# EAGLE design barBloom3 (EAGLE 7.7.0)
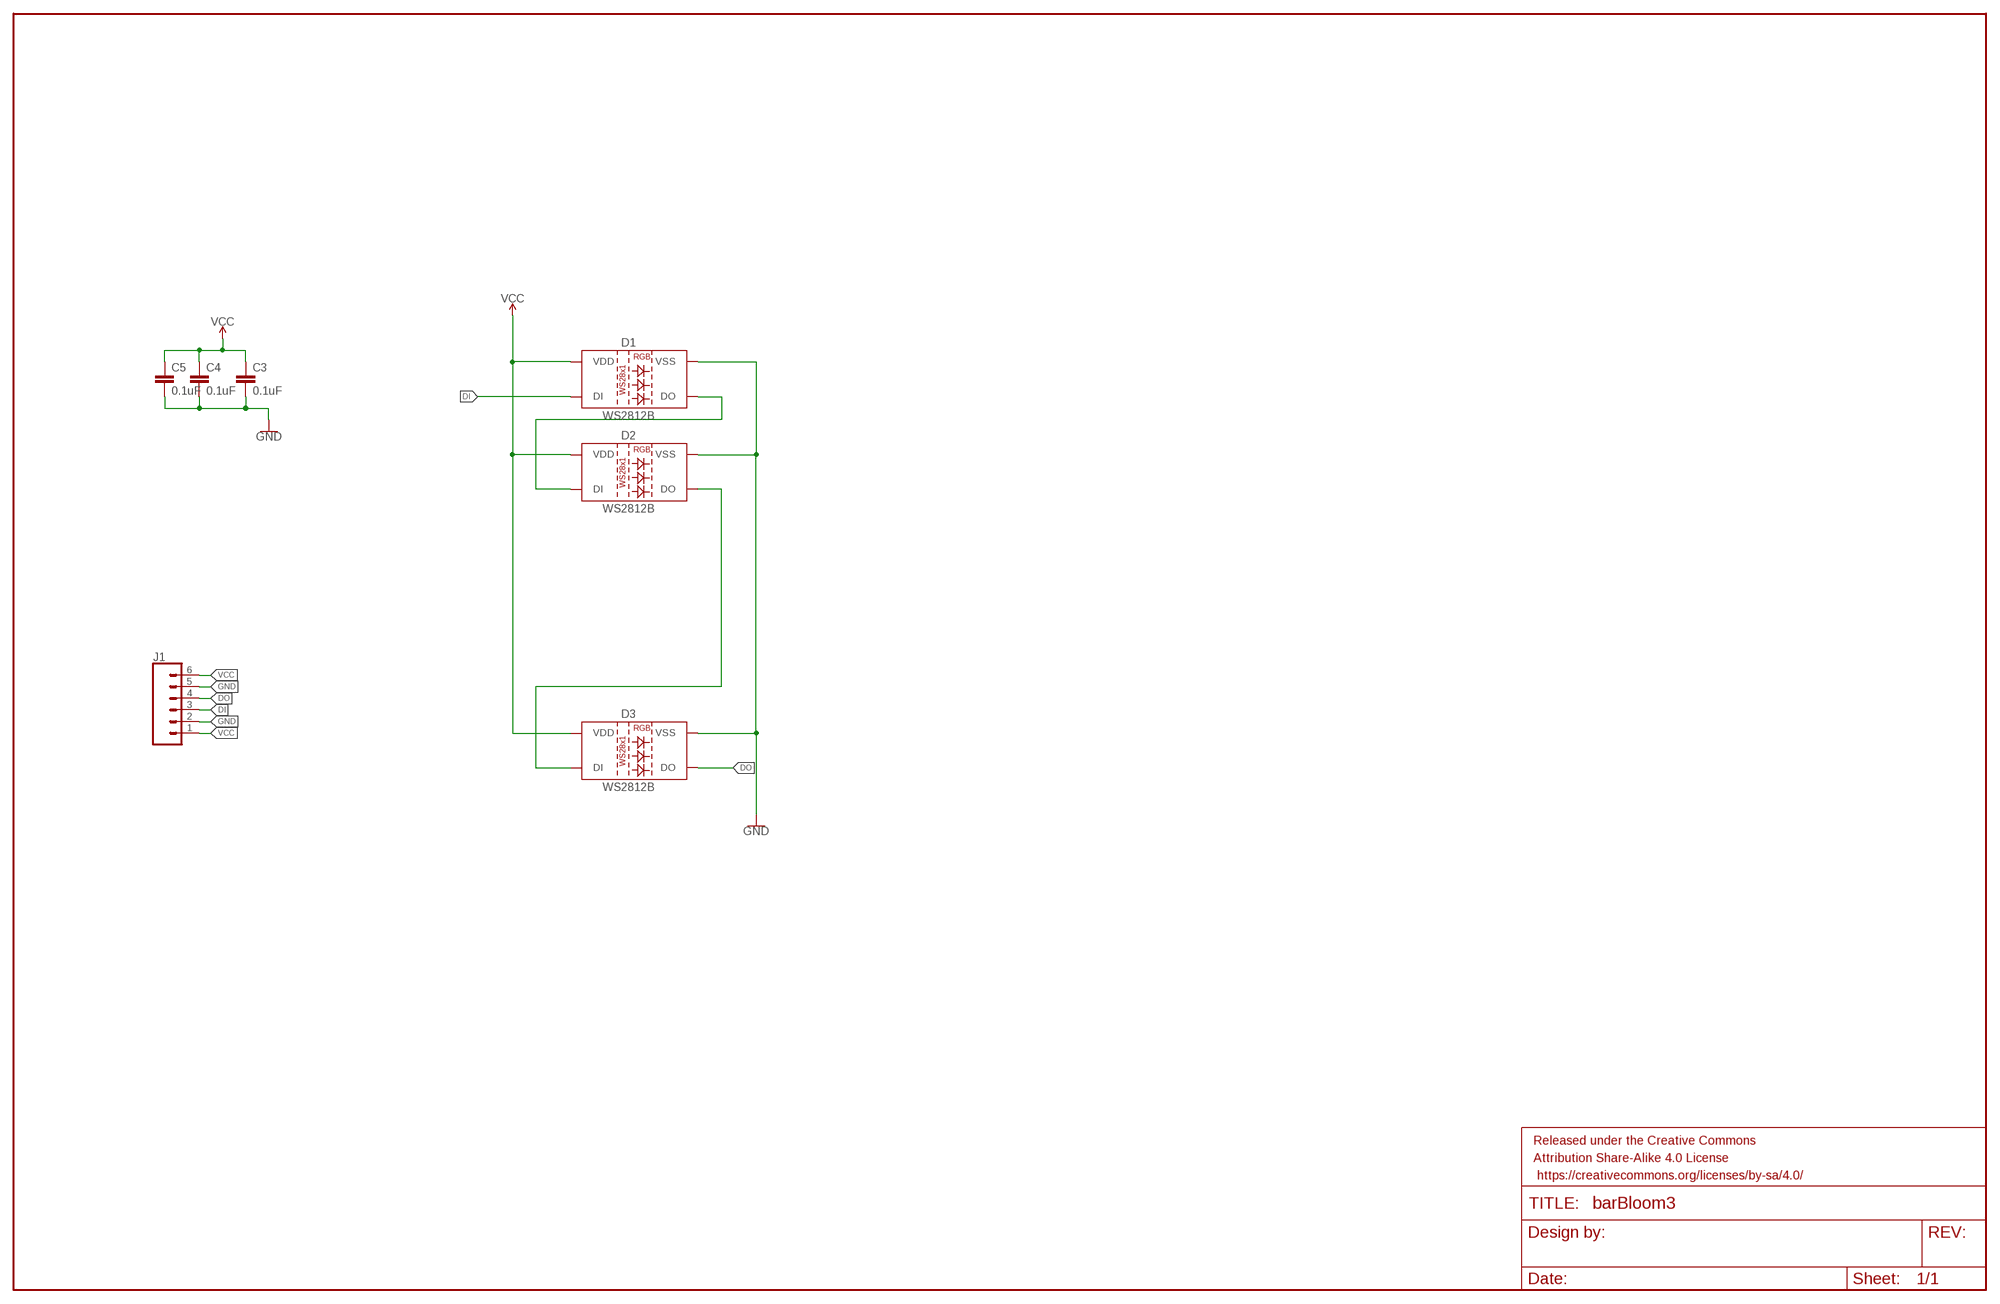
[diagram p0: schematic, sheet 1]

## Parts
C3  0.1uF  0.1UF-0603-25V-(+80/-20%)  [0603]
C4  0.1uF  0.1UF-0603-25V-(+80/-20%)  [0603]
C5  0.1uF  0.1UF-0603-25V-(+80/-20%)  [0603]
D1  WS2812B  [WS2812B]
D2  WS2812B  [WS2812B]
D3  WS2812B  [WS2812B]
FRAME1  FRAME-LEDGER  [CREATIVE_COMMONS]
J1  CONN_06SMD-STRAIGHT-ALT-FEMALE  [1X06_SMD_STRAIGHT_ALT]

## Nets
DI: D1.4(DI) J1.3
DO: D3.2(DO) J1.4
GND: C3.2 C4.2 C5.2 D1.3(VSS) D2.3(VSS) D3.3(VSS) J1.2 J1.5
N$2: D1.2(DO) D2.4(DI)
N$11: D2.2(DO) D3.4(DI)
VCC: C3.1 C4.1 C5.1 D1.1(VDD) D2.1(VDD) D3.1(VDD) J1.1 J1.6

## Library data of the parts
C3-C5 = SparkFun-Capacitors:0.1UF: 0.1µF ceramic capacitors A capacitor is a passive two-terminal electrical component used to store electrical energy temporarily in an electric field.; PROD_ID: CAP-00810
D1-D3 = SparkFun-LED:WS2812B: WS2812B SMD addressable RGB LED 5x5mm SMD LED with built-in controller IC. Color: Red/Green/Blue mC Rating: RGB: 390, 660, 180 mcd Forward Voltage: RGB: 2.0, 3.0, 3.0 V Packages:WS2812B SparkFun Products: Blynk Board - ESP8266 <https://www.sparkfun.com/products/13794>; PROD_ID: DIO-12503
FRAME1 = SparkFun-Aesthetics:FRAME-LEDGER: Schematic Frame - Ledger Standard 11x14 US Ledger frame
J1 = SparkFun-Connectors:CONN_06: Multi connection point. Often used as Generic Header-pin footprint for 0.1 inch spaced/style header connections On any of the 0.1 inch spaced packages, you can populate with these: Break Away Headers - Straight <https://www.sparkfun.com/products/116> (PRT-00116) Break Away Male Headers - Right Angle <https://www.sparkfun.com/products/553> (PRT-00553) Female Headers <https://www.sparkfun.com/products/115> (PRT-00115) Break Away Headers - Machine Pin <https://www.sparkfun.com/products/117> (PRT-00117) Break Away Female Headers - Swiss Machine Pin <https://www.sparkfun.com/products/743> (PRT-00743) Arduino Stackable Header - 6 Pin <https://www.sparkfun.com/products/9280> (PRT-09280) For SCREWTERMINALS and SPRING TERMINALS visit here: Screw Terimnals on SparkFun.com <https://www.sparkfun.com/search/results?term=Screw+Terminals> (5mm/3.5mm/2.54mm spacing) This device is also useful as a general connection point to wire up your design to another part of your project. Our various solder wires solder well into these plated through hole pads. Hook-Up Wire - Assortment (Stranded, 22 AWG) <https://www.sparkfun.com/products/11375> (PRT-11375) Hook-Up Wire - Assortment (Solid Core, 22 AWG) <https://www.sparkfun.com/products/11367> (PRT-11367) View the entire wire category on our website here <https://www.sparkfun.com/categories/141>; PROD_ID: CONN-10203

## Board
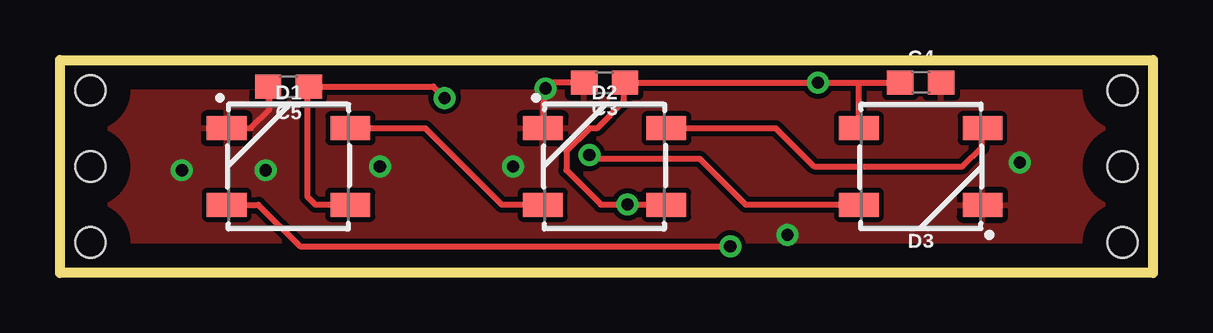
[diagram p1: board, top side]
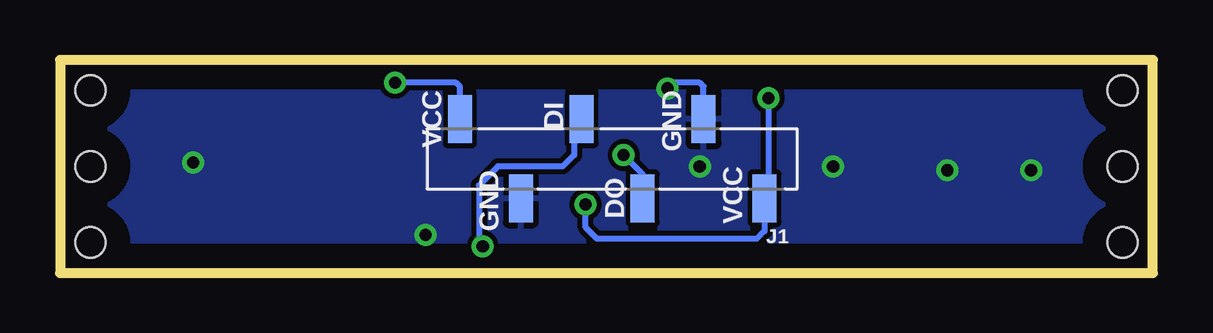
[diagram p2: board, bottom side, seen from below]

Size 45.56 x 8.89 mm. Coordinates in mm from the lower left corner, seen from the top.
Outline: 45.56,8.89 45.56,0 0,0 0,8.89 45.56,8.89
Copper layers (1*16): Top 0.035mm / dielectric 1.5mm / Bottom 0.035mm
Design rules "default": minimum track width 10mil, minimum drill 24mil, track to track 8mil, track to pad 8mil, pad to pad 8mil, via to via 8mil, smd to smd 8mil, copper to edge 40mil, drill to drill 8mil, minimum pad ring 10mil, minimum via ring 8mil, stop-mask expansion 4mil, vias tented up to drill 0mil, thermal gap 10mil
Holes 1.27 mm at 44.29,1.27 44.29,7.62 1.27,1.27 1.27,7.62 1.27,4.45 44.29,4.45

### Footprints (pad centres in the part's own frame; a part is rotated, then mirrored left to right if it is on the bottom)
0603 = smd 1.1 x 1: 1 -0.85,0; 2 0.85,0
WS2812B = smd 1.651 x 1: 1 2.577,-1.6; 2 2.577,1.6; 3 -2.577,1.6; 4 -2.577,-1.6
1X06_SMD_STRAIGHT_ALT = smd 1 x 2: 1 0,-1.65; 2 -2.54,1.65; 3 -5.08,-1.65; 4 -7.62,1.65; 5 -10.16,-1.65; 6 -12.7,1.65

### Placement (x,y rotation side)
C3  22.7,7.94 180 top
C4  35.88,7.94 0 top
C5  9.53,7.78 180 top
D1  9.53,4.45 0 top
D2  22.7,4.45 0 top
D3  35.88,4.45 180 top
FRAME1  -101.6,1.27 0 top  (outside the outline)
J1  28.89,4.76 180 bottom

### Tracks (layer width: path | path; a pad name or v marks a point on that pad's centre or on a via)
DI  (via drill 0.51)
  Top 0.254: D1.4 8.27,2.85 10,1.11 v27.94,1.11
  Bottom 0.254: J1.3 24.13,6.09 24.13,4.92 24.61,4.45 27.3,4.45 28.1,3.65 28.1,1.27 v27.94,1.11
DO  (via drill 0.51)
  Top 0.254: D3.2 28.59,2.85 26.67,4.76 22.23,4.76 v22.07,4.92
  Bottom 0.254: v22.07,4.92 21.27,4.13 J1.4
GND  (via drill 0.51)
  Top 0.254: D1.3 7.95,6.04 8.73,6.83 8.73,7.72 C5.2 | 21.91,7.94 C3.2 20.48,7.94 v20.24,7.7 20.16,7.62 20.16,6.08 D2.3
  Bottom 0.254: J1.5 18.73,7.78 18.89,7.94 20,7.94 v20.24,7.7
  other vias: 5.08,4.29 8.57,4.29 13.34,4.45 18.89,4.45 30.32,1.59 40.01,4.6
  pour Top: 45.56,8.89 45.56,0 0,0 0,8.89
  pour Bottom: 45.56,8.89 45.56,0 0,0 0,8.89
N$2
  Top 0.254: D1.2 15.23,6.04 18.41,2.86 D2.4
N$11
  Top 0.254: D2.2 29.83,6.04 31.43,4.45 37.62,4.45 38.42,5.24 38.42,6.01 D3.4
VCC  (via drill 0.51)
  Top 0.254: v16.03,7.3 15.56,7.78 C5.1 10.32,7.72 10.32,3.17 10.65,2.85 D1.1 | 33.34,7.94 v31.59,7.94 C3.1 23.5,7.88 23.5,7.14 22.38,6.03 22.07,6.03 21.11,5.08 21.11,4.29 22.54,2.86 v23.65,2.86 25.27,2.86 D2.1 | 33.34,7.94 C4.1 | D3.1 33.3,7.9 33.34,7.94
  Bottom 0.254: v16.03,7.3 16.03,3.27 J1.6 16.19,1.75 16.51,1.43 23.18,1.43 23.65,1.91 v23.65,2.86 | J1.1 28.89,7.78 29.05,7.94 v31.59,7.94

### Text on the board
bPlace: GND | VCC | DI | VCC | DO | GND